# Altium schematic sheet IDCI_WifiNode_Blk.SchDoc: WifiNode
size A4; Author: Luciano Lopez; CompanyName: UTN
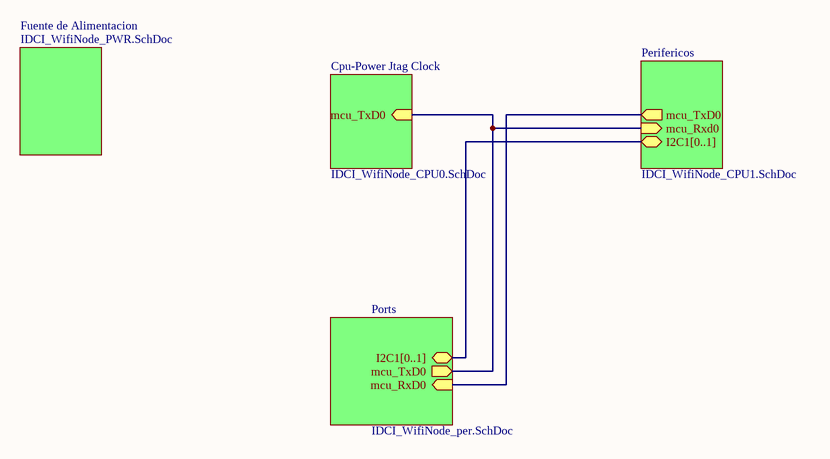
[diagram p0: IDCI_WifiNode_Blk.SchDoc]

## Sub-sheets
Cpu-Power Jtag Clock = IDCI_WifiNode_CPU0.SchDoc: mcu_TxD0 (in)
Fuente de Alimentacion = IDCI_WifiNode_PWR.SchDoc: no entries
Perifericos = IDCI_WifiNode_CPU1.SchDoc: mcu_TxD0 (out), mcu_Rxd0 (in), I2C1[0..1] (bidir)
Ports = IDCI_WifiNode_per.SchDoc: mcu_TxD0 (out), mcu_RxD0 (in), I2C1[0..1] (bidir)

## Nets
(unnamed): sheet Cpu-Power Jtag Clock/mcu_TxD0, sheet Perifericos/mcu_Rxd0, sheet Ports/mcu_TxD0
(unnamed): sheet Perifericos/mcu_TxD0, sheet Ports/mcu_RxD0

## Buses and harness runs
bus sheet Perifericos/I2C1[0..1] = sheet Ports/I2C1[0..1]

## Notes on the sheet
- Title:
- Size:
- Author:
- A4
- Sheet
- of
- Revision:
- File:
- Date: